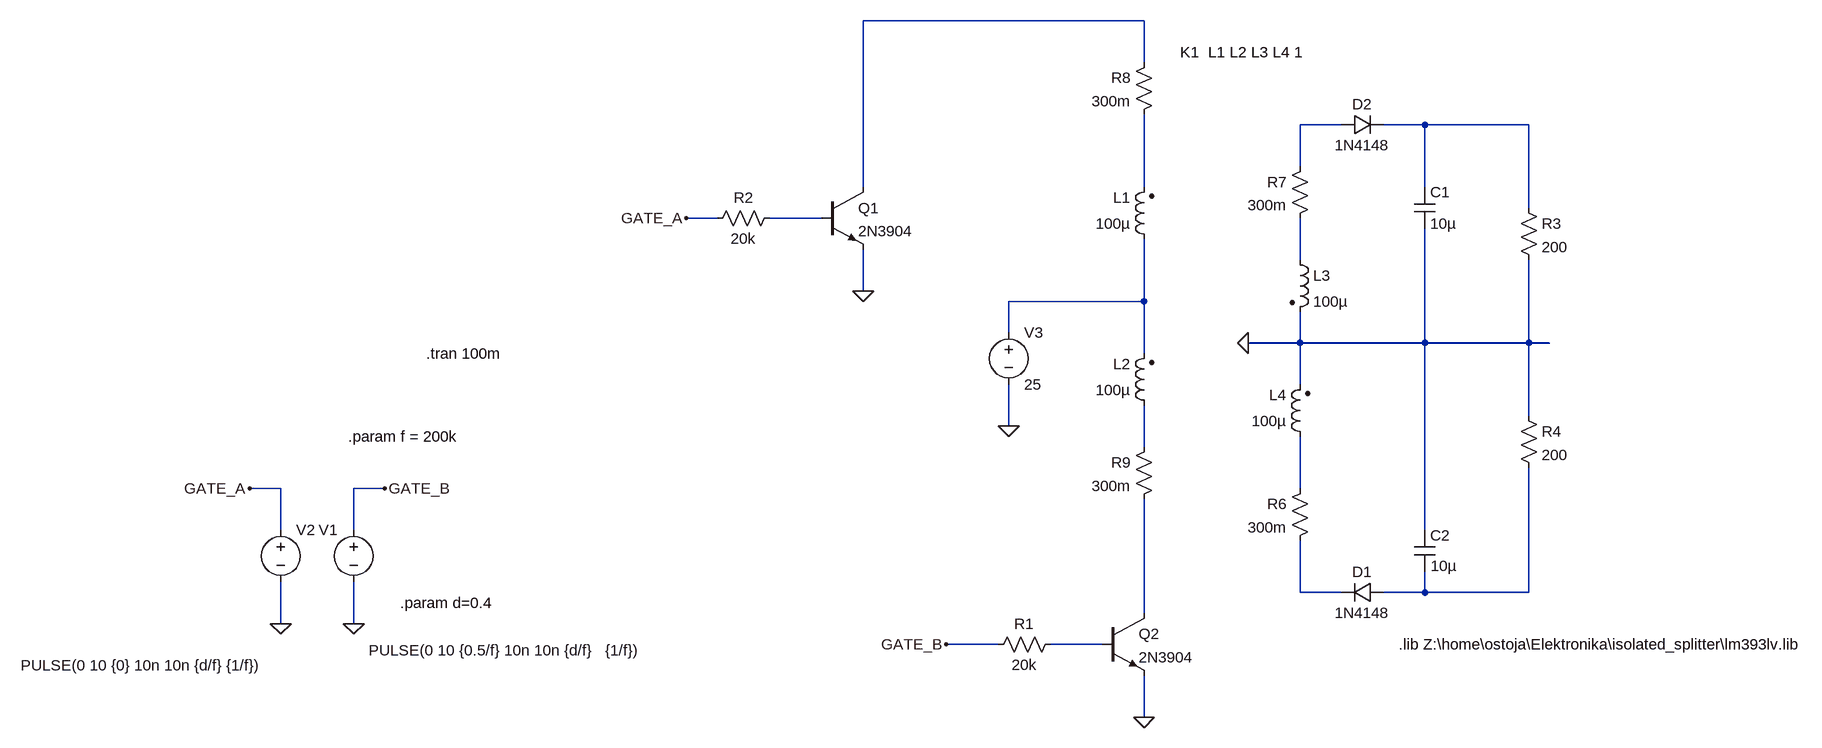
[diagram p0: schematic Draft1.asc]
Draft1.asc, the LTspice schematic file:
Version 4
SHEET 1 1792 680
WIRE 32 -1088 -400 -1088
WIRE 32 -1024 32 -1088
WIRE 336 -928 272 -928
WIRE 464 -928 400 -928
WIRE 624 -928 464 -928
WIRE 272 -864 272 -928
WIRE -400 -832 -400 -1088
WIRE 32 -832 32 -944
WIRE 464 -832 464 -928
WIRE 624 -800 624 -928
WIRE -624 -784 -672 -784
WIRE -464 -784 -544 -784
WIRE 272 -720 272 -784
WIRE -400 -672 -400 -736
WIRE 32 -656 32 -752
WIRE 32 -656 -176 -656
WIRE -176 -608 -176 -656
WIRE 272 -592 272 -640
WIRE 272 -592 192 -592
WIRE 464 -592 464 -768
WIRE 464 -592 272 -592
WIRE 624 -592 624 -720
WIRE 624 -592 464 -592
WIRE 656 -592 624 -592
WIRE 32 -576 32 -656
WIRE 272 -528 272 -592
WIRE 624 -480 624 -592
WIRE -176 -464 -176 -528
WIRE 32 -432 32 -496
WIRE -1296 -368 -1344 -368
WIRE -1136 -368 -1184 -368
WIRE 272 -368 272 -448
WIRE -1296 -304 -1296 -368
WIRE -1184 -304 -1184 -368
WIRE 464 -304 464 -592
WIRE 272 -208 272 -288
WIRE 336 -208 272 -208
WIRE 464 -208 464 -240
WIRE 464 -208 400 -208
WIRE 624 -208 624 -400
WIRE 624 -208 464 -208
WIRE 32 -176 32 -352
WIRE -1296 -160 -1296 -224
WIRE -1184 -160 -1184 -224
WIRE -192 -128 -272 -128
WIRE -32 -128 -112 -128
WIRE 32 -16 32 -80
FLAG -1184 -160 0
FLAG -1136 -368 GATE_B
FLAG -1344 -368 GATE_A
FLAG -176 -464 0
FLAG -1296 -160 0
FLAG 192 -592 0
FLAG -672 -784 GATE_A
FLAG -272 -128 GATE_B
FLAG -400 -672 0
FLAG 32 -16 0
SYMBOL voltage -1184 -320 M0
WINDOW 123 0 0 Left 0
WINDOW 39 0 0 Left 0
WINDOW 3 -444 201 Left 2
SYMATTR Value PULSE(0 10 {0.5/f} 10n 10n {d/f}   {1/f})
SYMATTR InstName V1
SYMBOL voltage -1296 -320 R0
WINDOW 123 0 0 Left 0
WINDOW 39 0 0 Left 0
WINDOW 3 -400 224 Left 2
SYMATTR Value PULSE(0 10 {0} 10n 10n {d/f} {1/f})
SYMATTR InstName V2
SYMBOL voltage -176 -624 R0
WINDOW 123 0 0 Left 0
WINDOW 39 0 0 Left 0
SYMATTR InstName V3
SYMATTR Value 25
SYMBOL cap 448 -832 R0
SYMATTR InstName C1
SYMATTR Value 10µ
SYMBOL cap 448 -304 R0
WINDOW 3 25 55 Left 2
SYMATTR Value 10µ
SYMATTR InstName C2
SYMBOL ind2 48 -736 R180
WINDOW 0 36 80 Left 2
WINDOW 3 36 40 Left 2
SYMATTR InstName L1
SYMATTR Value 100µ
SYMATTR Type ind
SYMATTR SpiceLine Rser=0.2
SYMBOL ind2 48 -480 R180
WINDOW 0 36 80 Left 2
WINDOW 3 36 40 Left 2
SYMATTR InstName L2
SYMATTR Value 100µ
SYMATTR Type ind
SYMATTR SpiceLine Rser=0.2
SYMBOL ind2 256 -736 R0
SYMATTR InstName L3
SYMATTR Value 100µ
SYMATTR Type ind
SYMATTR SpiceLine Rser=0.4
SYMBOL ind2 288 -432 R180
WINDOW 0 36 80 Left 2
WINDOW 3 36 40 Left 2
SYMATTR InstName L4
SYMATTR Value 100µ
SYMATTR Type ind
SYMATTR SpiceLine Rser=0.4
SYMBOL diode 336 -912 R270
WINDOW 0 32 32 VTop 2
WINDOW 3 0 32 VBottom 2
SYMATTR InstName D2
SYMATTR Value 1N4148
SYMBOL res 608 -816 R0
SYMATTR InstName R3
SYMATTR Value 200
SYMBOL res 608 -496 R0
SYMATTR InstName R4
SYMATTR Value 200
SYMBOL diode 400 -224 R90
WINDOW 0 0 32 VBottom 2
WINDOW 3 32 32 VTop 2
SYMATTR InstName D1
SYMATTR Value 1N4148
SYMBOL res 288 -384 M0
SYMATTR InstName R6
SYMATTR Value 300m
SYMBOL res 288 -880 M0
SYMATTR InstName R7
SYMATTR Value 300m
SYMBOL res 48 -1040 M0
SYMATTR InstName R8
SYMATTR Value 300m
SYMBOL res 48 -448 M0
SYMATTR InstName R9
SYMATTR Value 300m
SYMBOL res -528 -800 R90
WINDOW 0 0 56 VBottom 2
WINDOW 3 32 56 VTop 2
SYMATTR InstName R2
SYMATTR Value 20k
SYMBOL npn -464 -832 R0
SYMATTR InstName Q1
SYMATTR Value 2N3904
SYMBOL res -96 -144 R90
WINDOW 0 0 56 VBottom 2
WINDOW 3 32 56 VTop 2
SYMATTR InstName R1
SYMATTR Value 20k
SYMBOL npn -32 -176 R0
SYMATTR InstName Q2
SYMATTR Value 2N3904
TEXT -1072 -576 Left 2 !.tran 100m
TEXT 88 -1040 Left 2 !K1  L1 L2 L3 L4 1
TEXT -1192 -448 Left 2 !.param f = 200k
TEXT -1112 -192 Left 2 !.param d=0.4
TEXT 424 -128 Left 2 !.lib Z:\\home\\ostoja\\Elektronika\\isolated_splitter\\lm393lv.lib

The netlist it stands for:
* Draft1.asc
V1 GATE_B 0 PULSE(0 10 {0.5/f} 10n 10n {d/f}   {1/f})
V2 GATE_A 0 PULSE(0 10 {0} 10n 10n {d/f} {1/f})
V3 N007 0 25
C1 N003 0 10µ
C2 0 N011 10µ
L1 N007 N004 100µ Rser=0.2
L2 N008 N007 100µ Rser=0.2
L3 N006 0 100µ Rser=0.4
L4 N009 0 100µ Rser=0.4
D2 N002 N003 1N4148
R3 N003 0 200
R4 0 N011 200
D1 N011 N010 1N4148
R6 N009 N010 300m
R7 N002 N006 300m
R8 N001 N004 300m
R9 N008 N012 300m
R2 N005 GATE_A 20k
Q1 N001 N005 0 0 2N3904
R1 N013 GATE_B 20k
Q2 N012 N013 0 0 2N3904
.model D D
.lib standard.dio
.model NPN NPN
.model PNP PNP
.lib standard.bjt
.tran 100m
K1  L1 L2 L3 L4 1
.param f = 200k
.param d=0.4
.lib Z:\home\ostoja\Elektronika\isolated_splitter\lm393lv.lib
.backanno
.end